# Altium project TESIS.PrjPCB
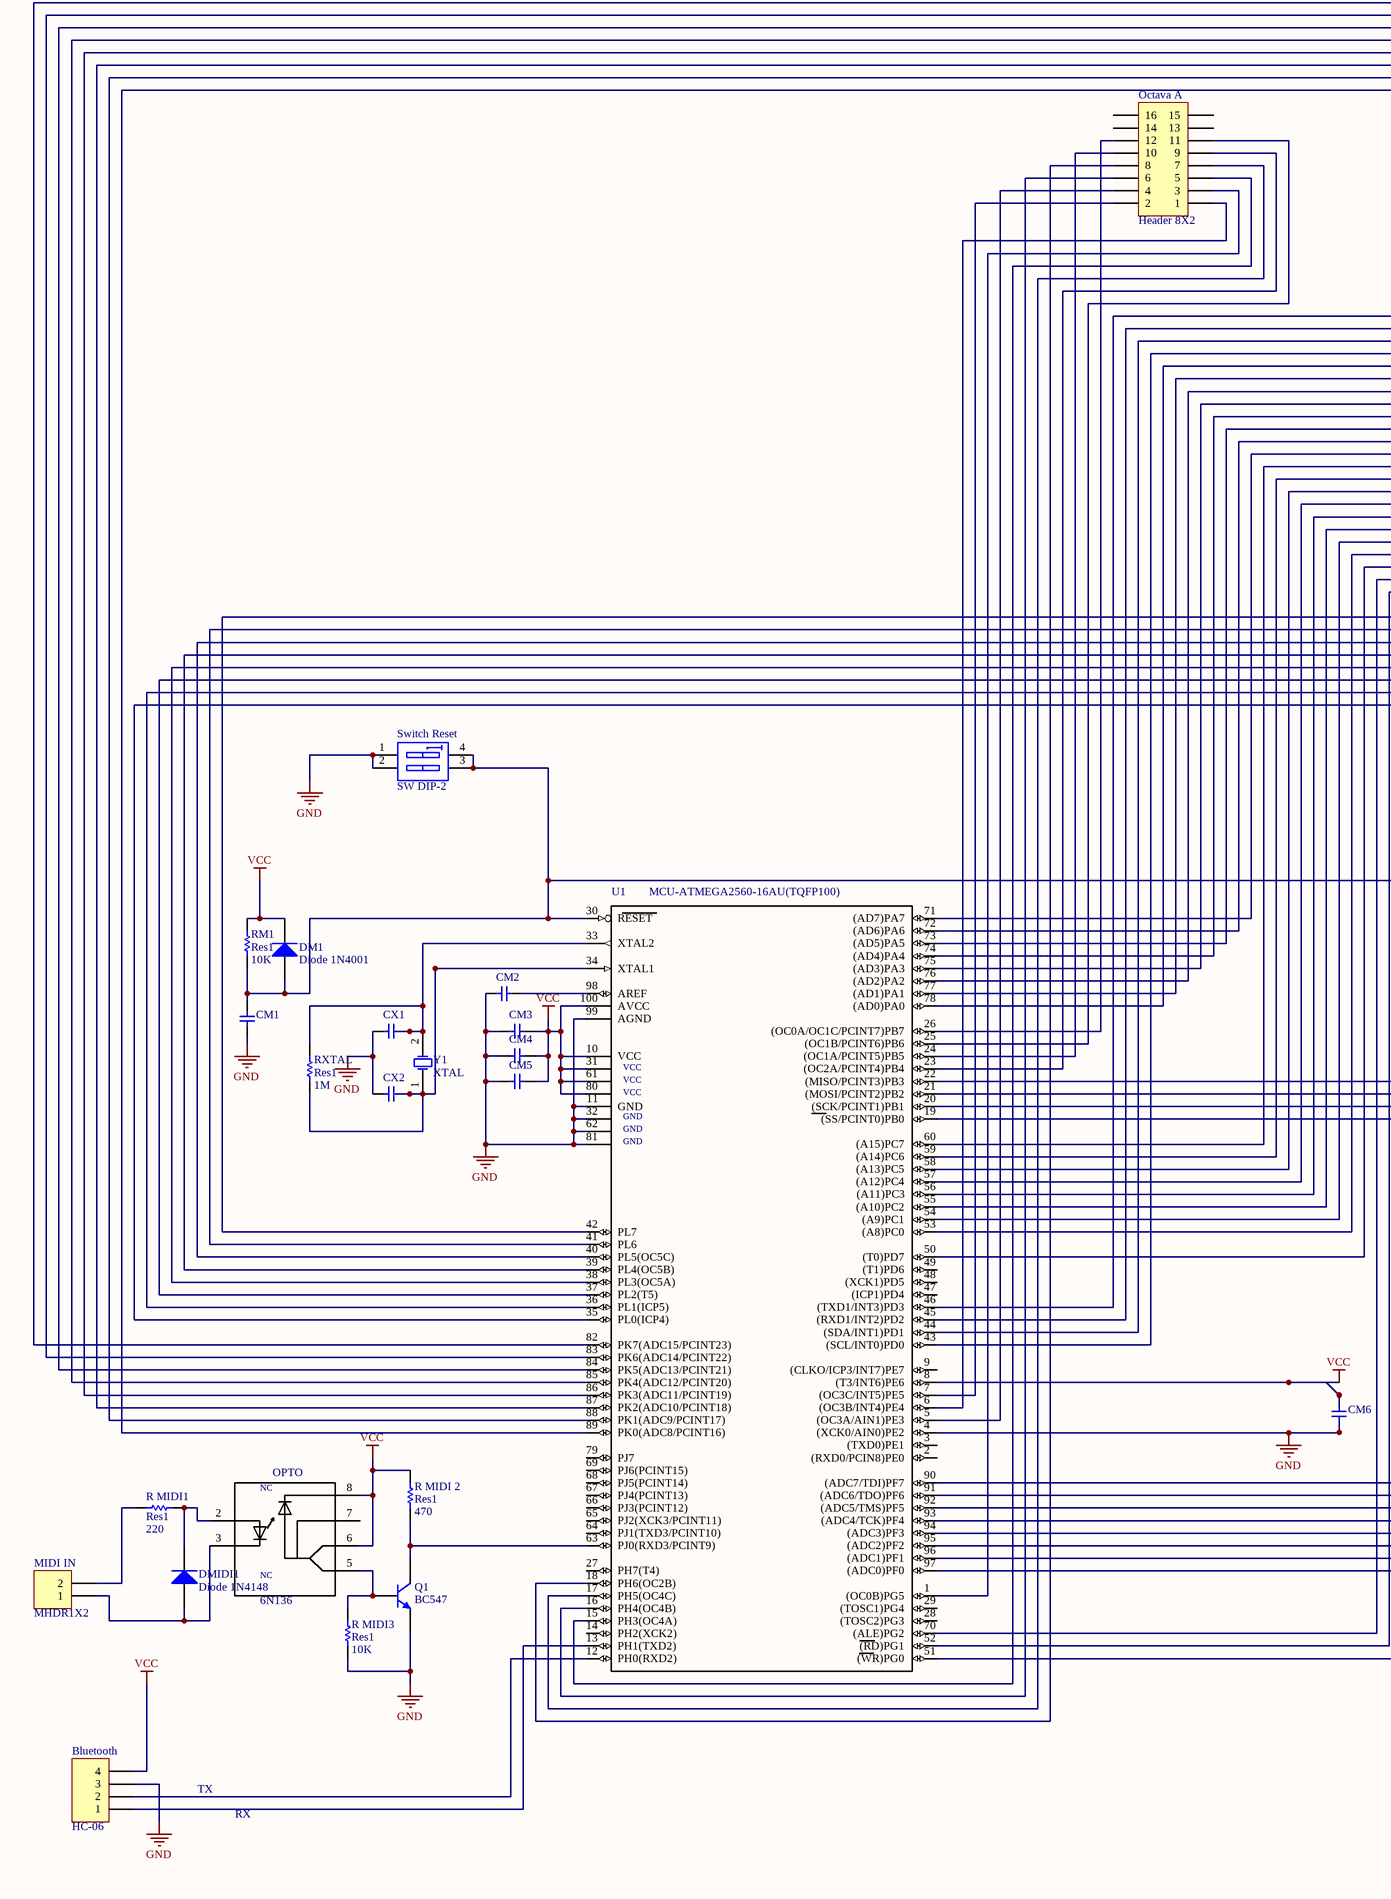
[diagram p0: Sheet1.SchDoc, left]
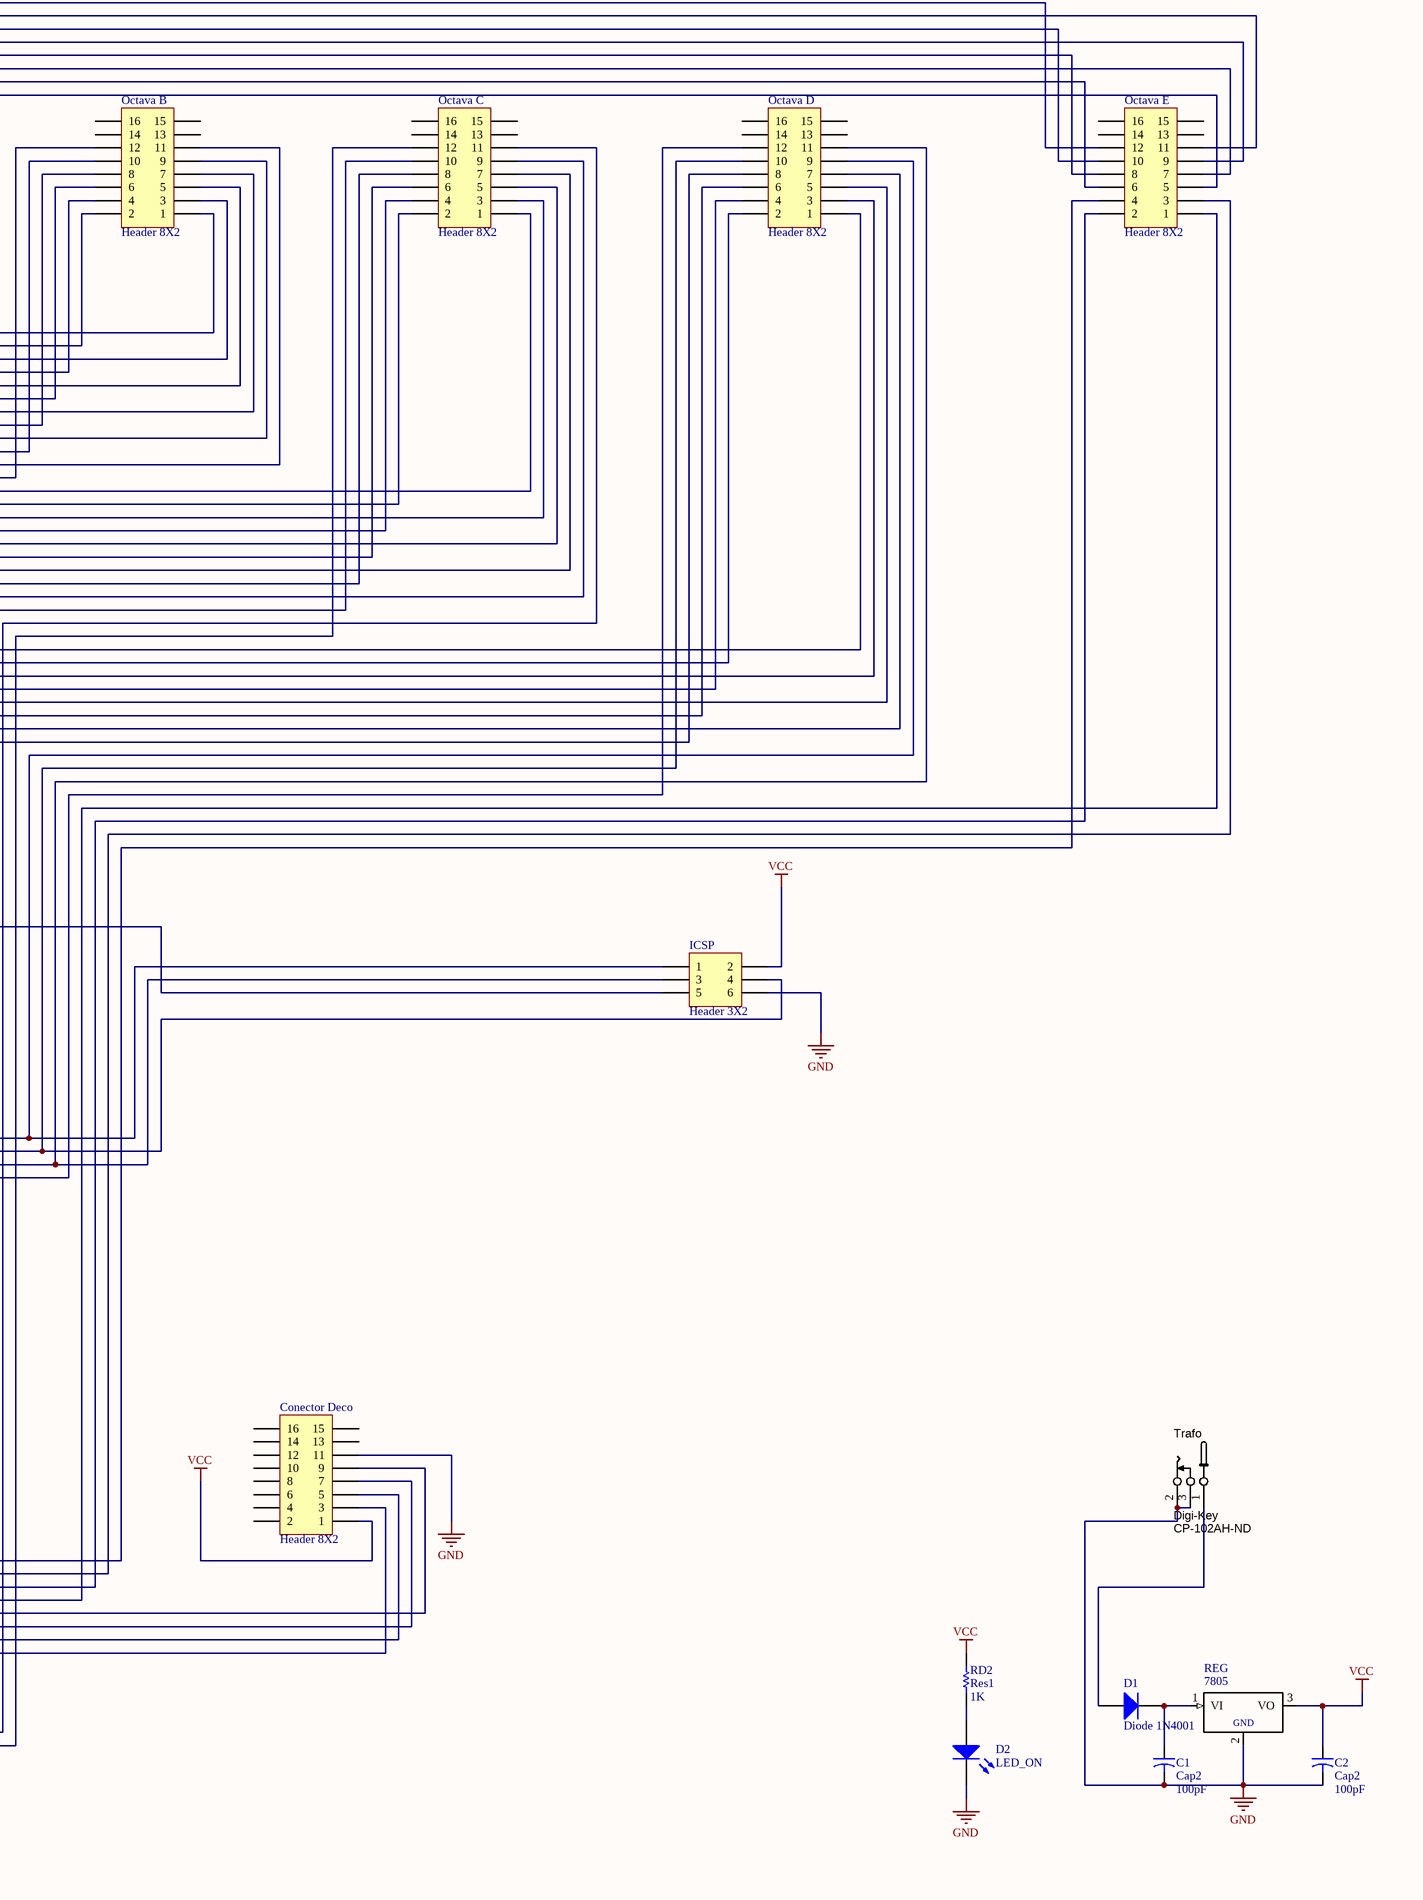
[diagram p1: Sheet1.SchDoc, right]
1 sheet, 36 parts. Net scope: global (net labels, ports and power ports of the same name join across sheets).
Board file: PCB1.PcbDoc

## Sheet Sheet1.SchDoc
size A2; PageSetup: Record=PageOptions|CenterHorizontal=True|CenterVertical=True|PrintScale=1.00|XCorrection=1.00|YCorrection=1.00|PrintKind=1|BorderSize=5000000|LeftOffset=0|BottomOffset=0|Orientation=2|PaperLength=1000|PaperWidth=1000|Scale=100|PaperSource=7|PrintQuality=-3|MediaType=1|DitherType=10|PrintScaleMode=1|PaperKind=A3|PaperIndex=8

### Parts
Bluetooth  HC-06  [MHDR1X4]
C1  Cap2  value 100pF  [CAPR5-4X5]
C2  Cap2  value 100pF  [CAPR5-4X5]
CM1  (no value)  [C Disc 8x2.5-5.0]
CM2  (no value)  [C Disc 8x2.5-5.0]
CM3  (no value)  [C Disc 8x2.5-5.0]
CM4  (no value)  [C Disc 8x2.5-5.0]
CM5  (no value)  [C Disc 8x2.5-5.0]
CM6  (no value)  [C Disc 8x2.5-5.0]
Conector_Deco  Header 8X2  [HDR2X8]
CX1  (no value)  [C Disc 8x2.5-5.0]
CX2  (no value)  [C Disc 8x2.5-5.0]
D1  Diode 1N4001  [DO-41]
D2  LED_ON  [LED-0]
DM1  Diode 1N4001  [DO-41]
DMIDI1  Diode 1N4148  [DO-41]
ICSP  Header 3X2  [HDR2X3]
MIDI_IN  MHDR1X2  [MHDR1X2]
Octava_A  Header 8X2  [HDR2X8]
Octava_B  Header 8X2  [HDR2X8]
Octava_C  Header 8X2  [HDR2X8]
Octava_D  Header 8X2  [HDR2X8]
Octava_E  Header 8X2  [HDR2X8]
OPTO  6N136  [DIP762W50P254L977H451Q8]
Q1  BC547  [TO-92A]
R_MIDI1  Res1  value 220  [AXIAL-0.3]
R_MIDI3  Res1  value 10K  [AXIAL-0.3]
R_MIDI_2  Res1  value 470  [AXIAL-0.3]
RD2  Res1  value 1K  [AXIAL-0.3]
REG  7805  [TO92-]
RM1  Res1  value 10K  [AXIAL-0.3]
RXTAL  Res1  value 1M  [AXIAL-0.3]
Switch_Reset  SW DIP-2  [DIP-4]
Trafo  Supplier 1: Digi-Key  Supplier Part Number 1: CP-102AH-ND  [CONN_PWR_JACK_2.1x5.5mm]  (hidden comment: *)
U1  MCU-ATMEGA2560-16AU(TQFP100)  [TQFP100-0.5-14X14MM]
Y1  XTAL  [R38]

### Nets
GND: Bluetooth.3 C1.2 C2.2 CM1.2 CM2.1 CM3.1 CM4.1 CM5.1 CM6.2 Conector_Deco.11 CX1.1 CX2.1 D2.2(K) ICSP.6 Q1.1(E) R_MIDI3.2 REG.2(GND) Switch_Reset.1(A1) Switch_Reset.2(A2) Trafo.2 Trafo.3 U1.4((XCK0/AIN0)PE2) U1.11(GND) U1.32(GND1) U1.62(GND2) U1.81(GND3) U1.99(AGND)
VCC: Bluetooth.4 C2.1 CM3.2 CM4.2 CM5.2 CM6.1 Conector_Deco.1 DM1.2(K) ICSP.2 OPTO.6(C/VO) OPTO.8(C/VCC) R_MIDI_2.1 RD2.2 REG.3(VO) RM1.2 U1.8((T3/INT6)PE6) U1.10(VCC) U1.31(VCC1) U1.61(VCC2) U1.80(VCC3) U1.100(AVCC)
NetBluetooth_1: Bluetooth.1 U1.13(PH1(TXD2))
NetBluetooth_2: Bluetooth.2 U1.12(PH0(RXD2))
NetC1_1: C1.1 D1.2(K) REG.1(VI)
NetCM1_1: CM1.1 DM1.1(A) ICSP.5 RM1.1 Switch_Reset.3(B2) Switch_Reset.4(B1) U1.30(RESET)
NetCM2_2: CM2.2 U1.98(AREF)
NetConector_Deco_3: Conector_Deco.3 U1.97((ADC0)PF0)
NetConector_Deco_5: Conector_Deco.5 U1.96((ADC1)PF1)
NetConector_Deco_7: Conector_Deco.7 U1.95((ADC2)PF2)
NetConector_Deco_9: Conector_Deco.9 U1.94((ADC3)PF3)
NetCX1_2: CX1.2 RXTAL.2 U1.33(XTAL2) Y1.2(OSC2)
NetCX2_2: CX2.2 RXTAL.1 U1.34(XTAL1) Y1.1(OSC1)
NetD1_1: D1.1(A) Trafo.1
NetD2_1: D2.1(A) RD2.1
NetDMIDI1_1: DMIDI1.1(A) MIDI_IN.1 OPTO.3(C)
NetDMIDI1_2: DMIDI1.2(K) OPTO.2(A) R_MIDI1.1
NetICSP_1: ICSP.1 Octava_D.9 U1.22((MISO/PCINT3)PB3)
NetICSP_3: ICSP.3 Octava_D.11 U1.20((SCK/PCINT1)PB1)
NetICSP_4: ICSP.4 Octava_D.10 U1.21((MOSI/PCINT2)PB2)
NetMIDI_IN_2: MIDI_IN.2 R_MIDI1.2
NetOctava_A_1: Octava_A.1 U1.6((OC3B/INT4)PE4)
NetOctava_A_2: Octava_A.2 U1.7((OC3C/INT5)PE5)
NetOctava_A_3: Octava_A.3 U1.1((OC0B)PG5)
NetOctava_A_4: Octava_A.4 U1.5((OC3A/AIN1)PE3)
NetOctava_A_5: Octava_A.5 U1.15(PH3(OC4A))
NetOctava_A_6: Octava_A.6 U1.16(PH4(OC4B))
NetOctava_A_7: Octava_A.7 U1.17(PH5(OC4C))
NetOctava_A_8: Octava_A.8 U1.18(PH6(OC2B))
NetOctava_A_9: Octava_A.9 U1.23((OC2A/PCINT4)PB4)
NetOctava_A_10: Octava_A.10 U1.24((OC1A/PCINT5)PB5)
NetOctava_A_11: Octava_A.11 U1.25((OC1B/PCINT6)PB6)
NetOctava_A_12: Octava_A.12 U1.26((OC0A/OC1C/PCINT7)PB7)
NetOctava_B_1: Octava_B.1 U1.46((TXD1/INT3)PD3)
NetOctava_B_2: Octava_B.2 U1.45((RXD1/INT2)PD2)
NetOctava_B_3: Octava_B.3 U1.44((SDA/INT1)PD1)
NetOctava_B_4: Octava_B.4 U1.43((SCL/INT0)PD0)
NetOctava_B_5: Octava_B.5 U1.78((AD0)PA0)
NetOctava_B_6: Octava_B.6 U1.77((AD1)PA1)
NetOctava_B_7: Octava_B.7 U1.76((AD2)PA2)
NetOctava_B_8: Octava_B.8 U1.75((AD3)PA3)
NetOctava_B_9: Octava_B.9 U1.74((AD4)PA4)
NetOctava_B_10: Octava_B.10 U1.73((AD5)PA5)
NetOctava_B_11: Octava_B.11 U1.72((AD6)PA6)
NetOctava_B_12: Octava_B.12 U1.71((AD7)PA7)
NetOctava_C_1: Octava_C.1 U1.60((A15)PC7)
NetOctava_C_2: Octava_C.2 U1.59((A14)PC6)
NetOctava_C_3: Octava_C.3 U1.58((A13)PC5)
NetOctava_C_4: Octava_C.4 U1.57((A12)PC4)
NetOctava_C_5: Octava_C.5 U1.56((A11)PC3)
NetOctava_C_6: Octava_C.6 U1.55((A10)PC2)
NetOctava_C_7: Octava_C.7 U1.54((A9)PC1)
NetOctava_C_8: Octava_C.8 U1.53((A8)PC0)
NetOctava_C_9: Octava_C.9 U1.50((T0)PD7)
NetOctava_C_10: Octava_C.10 U1.70((ALE)PG2)
NetOctava_C_11: Octava_C.11 U1.52((RD)PG1)
NetOctava_C_12: Octava_C.12 U1.51((WR)PG0)
NetOctava_D_1: Octava_D.1 U1.42(PL7)
NetOctava_D_2: Octava_D.2 U1.41(PL6)
NetOctava_D_3: Octava_D.3 U1.40(PL5(OC5C))
NetOctava_D_4: Octava_D.4 U1.39(PL4(OC5B))
NetOctava_D_5: Octava_D.5 U1.38(PL3(OC5A))
NetOctava_D_6: Octava_D.6 U1.37(PL2(T5))
NetOctava_D_7: Octava_D.7 U1.36(PL1(ICP5))
NetOctava_D_8: Octava_D.8 U1.35(PL0(ICP4))
NetOctava_D_12: Octava_D.12 U1.19((SS/PCINT0)PB0)
NetOctava_E_1: Octava_E.1 U1.93((ADC4/TCK)PF4)
NetOctava_E_2: Octava_E.2 U1.92((ADC5/TMS)PF5)
NetOctava_E_3: Octava_E.3 U1.91((ADC6/TDO)PF6)
NetOctava_E_4: Octava_E.4 U1.90((ADC7/TDI)PF7)
NetOctava_E_5: Octava_E.5 U1.89(PK0(ADC8/PCINT16))
NetOctava_E_6: Octava_E.6 U1.88(PK1(ADC9/PCINT17))
NetOctava_E_7: Octava_E.7 U1.87(PK2(ADC10/PCINT18))
NetOctava_E_8: Octava_E.8 U1.86(PK3(ADC11/PCINT19))
NetOctava_E_9: Octava_E.9 U1.85(PK4(ADC12/PCINT20))
NetOctava_E_10: Octava_E.10 U1.84(PK5(ADC13/PCINT21))
NetOctava_E_11: Octava_E.11 U1.83(PK6(ADC14/PCINT22))
NetOctava_E_12: Octava_E.12 U1.82(PK7(ADC15/PCINT23))
NetOPTO_5: OPTO.5(E/GND) Q1.2(B) R_MIDI3.1
NetQ1_3: Q1.3(C) R_MIDI_2.2 U1.63(PJ0(RXD3/PCINT9))

Not connected (* = marked no-connect by the designer): Conector_Deco 2 4 6 8 10 12 13 14 15 16; Octava_A 13 14 15 16; Octava_B 13 14 15 16; Octava_C 13 14 15 16; Octava_D 13 14 15 16; Octava_E 13 14 15 16; OPTO 7(B/VB); U1 2((RXD0/PCIN8)PE0) 3((TXD0)PE1) 9((CLKO/ICP3/INT7)PE7) 14(PH2(XCK2)) 27(PH7(T4)) 28((TOSC2)PG3) 29((TOSC1)PG4) 47((ICP1)PD4) 48((XCK1)PD5) 49((T1)PD6) 64(PJ1(TXD3/PCINT10)) 65(PJ2(XCK3/PCINT11)) 66(PJ3(PCINT12)) 67(PJ4(PCINT13)) 68(PJ5(PCINT14)) 69(PJ6(PCINT15)) 79(PJ7)

### Notes on the sheet
- TX
- RX
- (in symbol 6N136) NC

### Library data of the parts
Bluetooth = MHDR1X4: Header, 4-Pin; LatestRevisionDate: 17-Jul-2002; LatestRevisionNote: Re-released for DXP Platform.; Publisher: Altium Limited
C1 C2 = Cap2: Capacitor; Published: 23-Sep-2002; PackageReference: CAPR5-4X5; Publisher: Altium Limited; PackageDescription: Capacitor; 2 Leads
CM1-CM6 CX1 CX2 = C: Capacitor, generic
Conector_Deco Octava_A Octava_B Octava_C Octava_D Octava_E = Header 8X2: Header, 8-Pin, Dual row; LatestRevisionDate: 17-Jul-2002; LatestRevisionNote: Re-released for DXP Platform.; Publisher: Altium Limited
D1 DM1 DMIDI1 = Diode 1N4001: 1 Amp General Purpose Rectifier; Published: 8-Jun-2000; LatestRevisionDate: 17-Jul-2002; LatestRevisionNote: Re-released for DXP Platform.; DatasheetVersion: 1998; PackageVersion: Aug-1999; PackageReference: DO-41; Publisher: Altium Limited; PackageDescription: Diode, Axial; Body 5.2 x 2.7 mm (LxDia. max), Lead Dia. 0.86 mm (max); Code_JEDEC: DO-204-AL; ComponentLink1Description: Manufacturer Link; ComponentLink1URL: http://www.fairchildsemi.com/; ComponentLink2Description: Datasheet; ComponentLink2URL: http://www.fairchildsemi.com/ds/1N%2F1N4001.pdf
D2 = LED0: Typical INFRARED GaAs LED; Published: 8-Jun-2000; LatestRevisionDate: 08-Jul-2005; LatestRevisionNote: Mech Layer 1 removed.; PackageReference: LED-0; Publisher: Altium Limited; PackageDescription: LED; 2 Leads
ICSP = Header 3X2: Header, 3-Pin, Dual row; LatestRevisionDate: 17-Jul-2002; LatestRevisionNote: Re-released for DXP Platform.; Publisher: Altium Limited
MIDI_IN = MHDR1X2: Header, 2-Pin; LatestRevisionDate: 17-Jul-2002; LatestRevisionNote: Re-released for DXP Platform.; Publisher: Altium Limited
OPTO = 6N136: 6N136 Series Single Channel 15 V 5300 Vrms Transistor Optocoupler - DIP-8; MF: Vishay; Price: 0.73 USD; Package: DIP-8 Vishay; Availability: Good; MP: 6N136; Value: *
Q1 = 2N3904: NPN General Purpose Amplifier; Published: 8-Jun-2000; LatestRevisionDate: 15-Jan-2003; LatestRevisionNote: PCB Footprint 'BCY-W3/D4.7' replaced; DatasheetVersion: 1997; PackageVersion: Sep-1998; PackageReference: TO-92A; Publisher: Altium Limited; PackageDescription: TO, Flat Index; 3 In-Line, Axial Leads; Body Dia. 4.5mm; Leads 0.51 x 0.48 mm (max); ComponentLink1Description: Manufacturer Link; ComponentLink1URL: http://www.fairchildsemi.com/; ComponentLink2Description: Datasheet; ComponentLink2URL: http://www.fairchildsemi.com/ds/2N%2F2N3904.pdf
R_MIDI1 R_MIDI3 R_MIDI_2 RD2 RM1 RXTAL = Res1: Resistor; Published: 8-Jun-2000; LatestRevisionDate: 17-Jul-2002; LatestRevisionNote: Re-released for DXP Platform.; PackageReference: AXIAL-0.3; Publisher: Altium Limited; PackageDescription: Axial Device, Thru-Hole; 2 Leads; 0.3 in Pin Spacing
REG = 7805: 5V Positive IC TO-220 Voltage Reg IC TO-220 VOLTAGE REG 5V POSITIVE; MF: MCM Electronics; Package: TO-220 MCM Electronics; MP: 7805; Availability: Unavailable; Price: None; Value: *
Switch_Reset = SW DIP-2: DIP Switch, 2 Position, SPST; Published: 24-Mar-1999; LatestRevisionDate: 17-Jul-2002; LatestRevisionNote: Re-released for DXP Platform.; PackageReference: DIP-4; Publisher: Altium Limited
Trafo = CONN_PWR_JACK_2.1x5.5mm: Power Connector, THT, 2.1mm ID, 5.5mm OD; Manufacturer 1: CUI Inc; Manufacturer Part Number 1: PJ-102AH; SCDType: undef; Category: Connectors; Mounting Type: Through Hole; Package / Case: PCB mount; Value: 2.1mm ID, 5.5mm OD
U1 = MCU-ATMEGA2560-16AU(TQFP100): ATmega Series 16 MHz 256 KB Flash 8 KB SRAM 8-Bit Microcontroller - TQFP-100; MF: Atmel; Package: TQFP-100 Atmel; MP: ATMEGA2560-16AU; Availability: Good; Price: 12.38 USD; Value: *
Y1 = XTAL: Crystal Oscillator; Published: 8-Jun-2000; LatestRevisionDate: 17-Jul-2002; LatestRevisionNote: Re-released for DXP Platform.; PackageReference: R38; Publisher: Altium Limited; PackageDescription: Crystal, Thru-Hole; 2 Leads; Body 3.1 x 8.2 mm (Dia.xH)